# Altium schematic sheet MCU2.SchDoc: MCU2
size A3; DocumentNumber: MB1144; Revision: C-02; SheetNumber: 4; SheetTotal: 25; PageSetup: Record=PageOptions|CenterHorizontal=True|CenterVertical=True|PrintScale=1.04|XCorrection=1.00|YCorrection=1.00|PrintKind=1|BorderSize=5000000|LeftOffset=0|BottomOffset=0|Orientation=2|PaperLength=1000|PaperWidth=1000|Scale=100|PaperSource=7|PrintQuality=600|MediaType=1|DitherType=10|PaperKind=A3|PrintScaleMode=1; Project: STM32L476G-EVAL; ModifiedDate: 9/23/2015
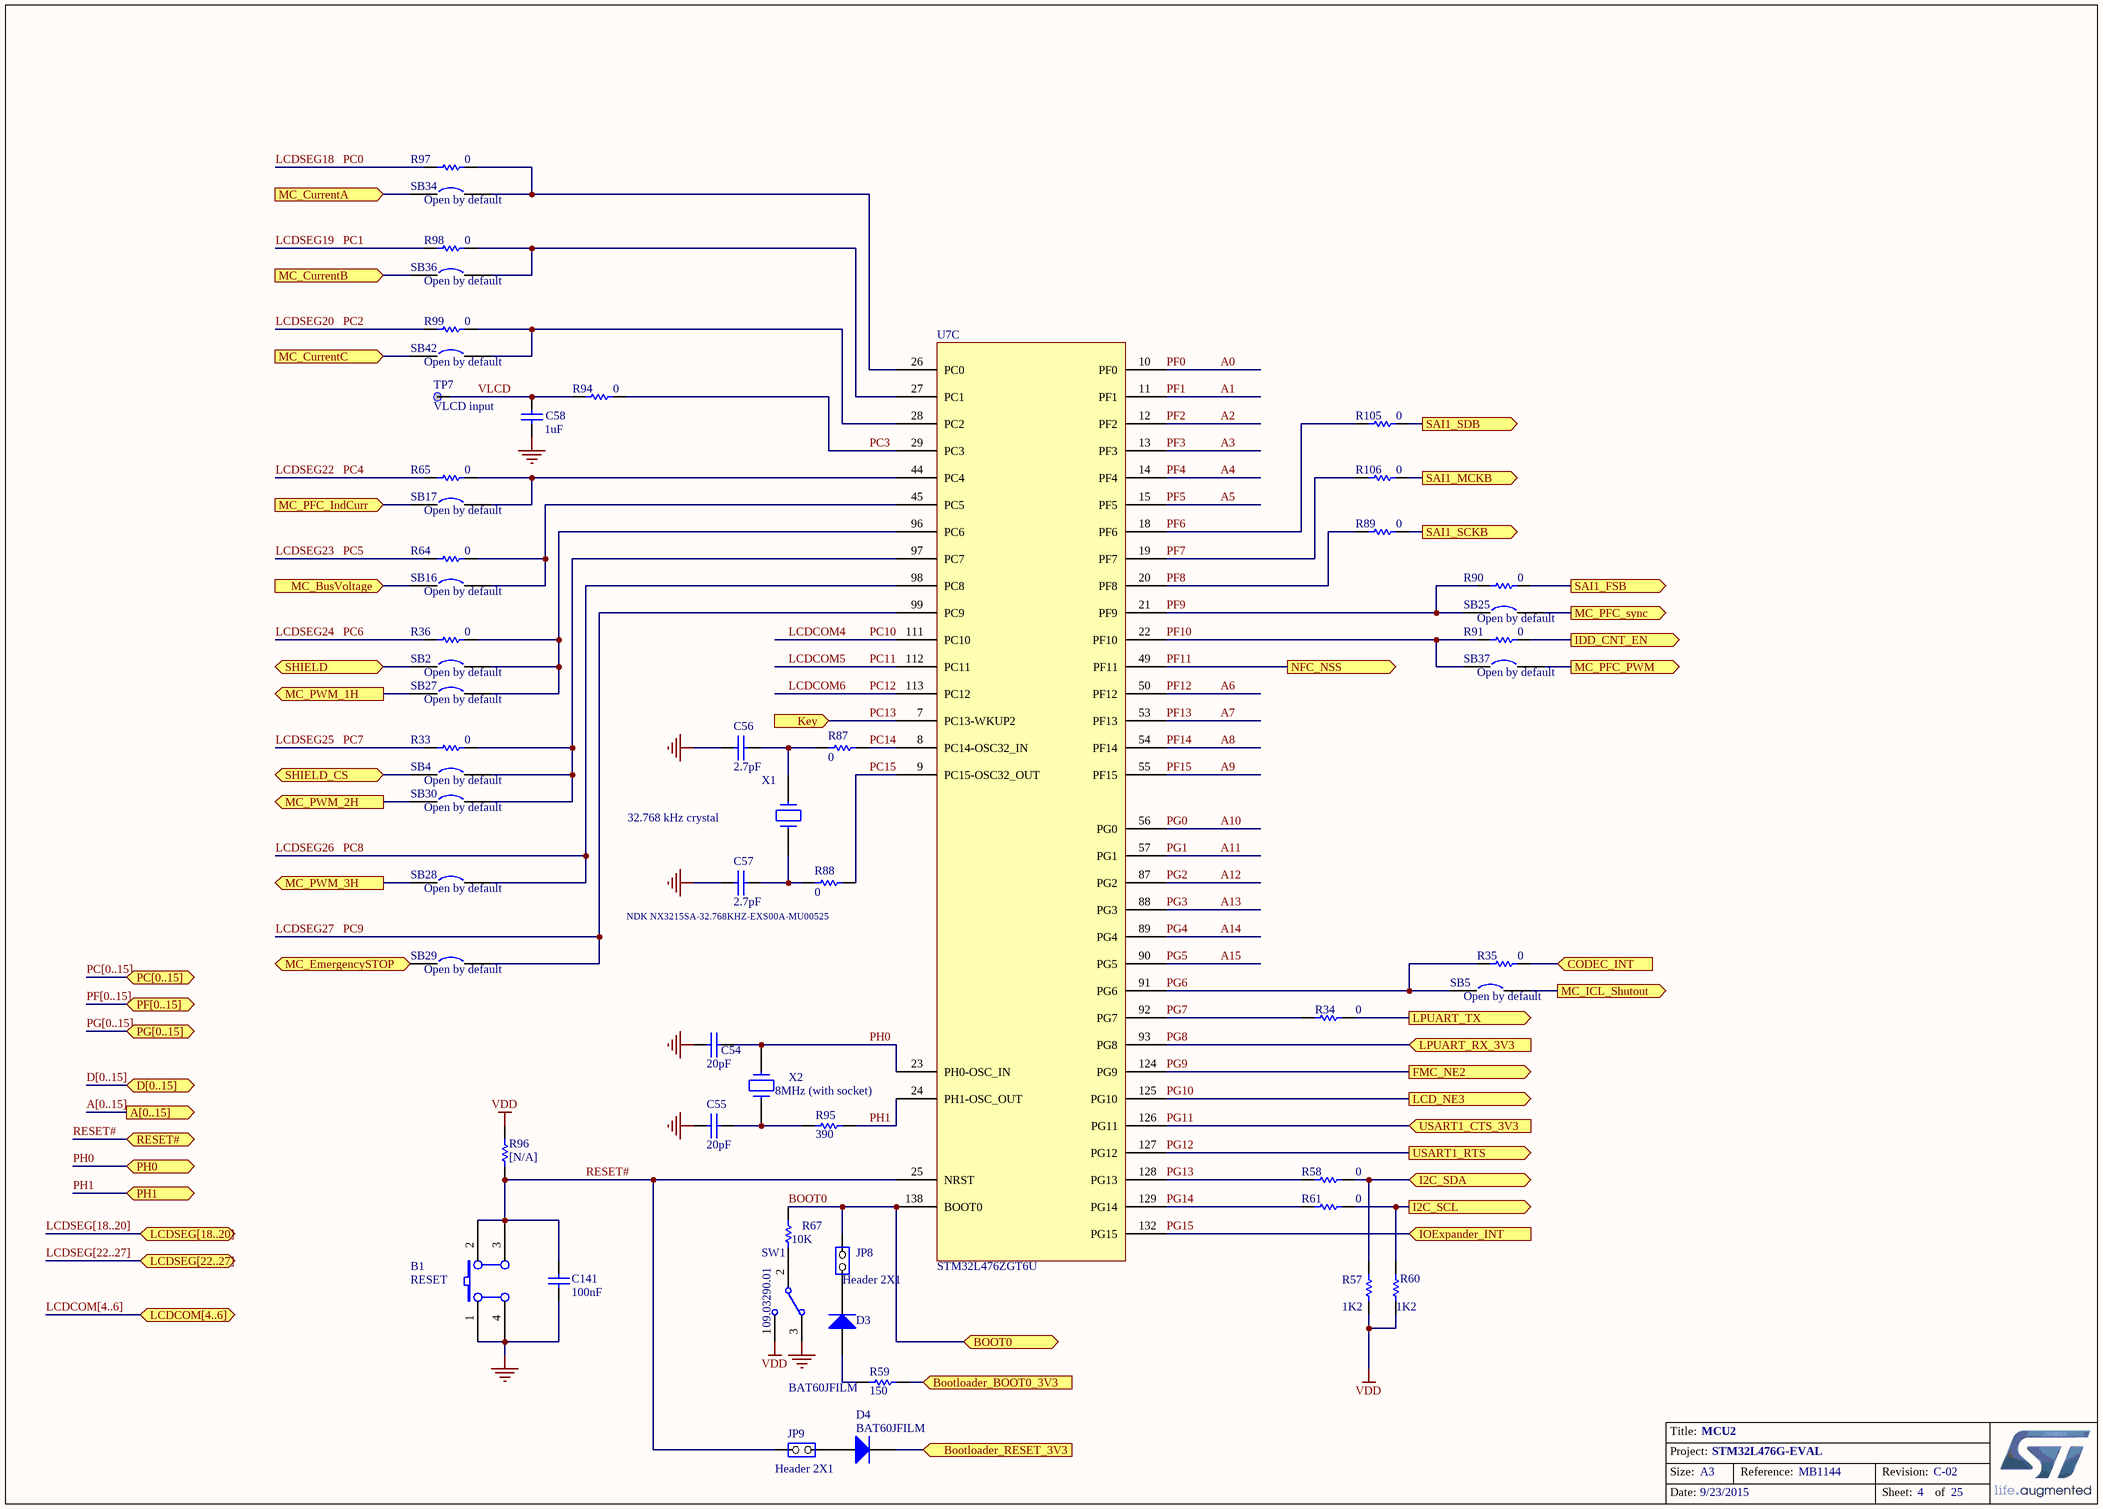
[diagram p0: MCU2.SchDoc]

## Parts
B1  RESET  [PB10]
C54  20pF  [0402R]
C55  20pF  [0402R]
C56  2.7pF  [0603C]
C57  2.7pF  [0603C]
C58  1uF  [0603C]
C141  100nF  [0402C]
D3  BAT60JFILM  [SOD-323]
D4  BAT60JFILM  [SOD-323]
JP8  Header 2X1  [SIP2]
JP9  Header 2X1  [SIP2]
R33  0  [SB_0603]
R34  0  [0603R]
R35  0  [SB_0603]
R36  0  [SB_0603]
R57  1K2  [0402R]
R58  0  [0603R]
R59  150  [0402R]
R60  1K2  [0402R]
R61  0  [0603R]
R64  0  [SB_0603]
R65  0  [SB_0603]
R67  10K  [0402R]
R87  0  [0603R]
R88  0  [0603R]
R89  0  [0603R]
R90  0  [SB_0603]
R91  0  [SB_0603]
R94  0  [0603R]
R95  390  [0603R]
R96  [N/A]  [0603R]
R97  0  [SB_0603]
R98  0  [SB_0603]
R99  0  [SB_0603]
R105  0  [0603R]
R106  0  [0603R]
SB2  Open by default  [SB_0603]
SB4  Open by default  [SB_0603]
SB5  Open by default  [SB_0603]
SB16  Open by default  [SB_0603]
SB17  Open by default  [SB_0603]
SB25  Open by default  [SB_0603]
SB27  Open by default  [SB_0603]
SB28  Open by default  [SB_0603]
SB29  Open by default  [SB_0603]
SB30  Open by default  [SB_0603]
SB34  Open by default  [SB_0603]
SB36  Open by default  [SB_0603]
SB37  Open by default  [SB_0603]
SB42  Open by default  [SB_0603]
SW1  09.03290.01  [SW1_3TH_2R54_10X2R5]
TP7  TP Name: VLCD input  [TP]  (hidden comment: [N/A])
U7  STM32L476ZGT6U  [TQFP144_0R5_22X22_SOCKET]  (part C of 3)
X1  NDK NX3215SA-32.768KHZ-EXS00A-MU00525  [XTAL_2SM_3R2X1R5]
X2  8MHz (with socket)  [XTAL_SOCKET]

## Ports
A[0..15] (out), BOOT0, Bootloader_BOOT0_3V3 (in), Bootloader_RESET_3V3 (in), CODEC_INT (in), D[0..15] (bidir), FMC_NE2 (out), I2C_SCL (out), I2C_SDA (bidir), IDD_CNT_EN (out), IOExpander_INT (in), Key (in), LCD_NE3 (out), LCDCOM[4..6] (bidir), LCDSEG[18..20] (bidir), LCDSEG[22..27] (bidir), LPUART_RX_3V3 (in), LPUART_TX (out), MC_BusVoltage (in), MC_CurrentA (in), MC_CurrentB (in), MC_CurrentC (in), MC_EmergencySTOP (in), MC_ICL_Shutout (out), MC_PFC_IndCurr (in), MC_PFC_PWM (out), MC_PFC_sync (out), MC_PWM_1H (out), MC_PWM_2H (out), MC_PWM_3H (out), NFC_NSS (out), PC[0..15] (bidir), PF[0..15] (bidir), PG[0..15] (bidir), PH0, PH1, RESET# (bidir), SAI1_FSB (out), SAI1_MCKB (out), SAI1_SCKB (out), SAI1_SDB (out), SHIELD, SHIELD_CS, USART1_CTS_3V3 (in), USART1_RTS (out)

## Nets
GND: B1.1(A0) B1.4(A1) C54.2 C55.2 C56.2 C57.2 C58.1 C141.1 SW1.3
VDD: R57.2 R60.2 R96.2 SW1.1
A0: U7.10(PF0)  [also labelled PF0]
A1: U7.11(PF1)  [also labelled PF1]
A2: U7.12(PF2)  [also labelled PF2]
A3: U7.13(PF3)  [also labelled PF3]
A4: U7.14(PF4)  [also labelled PF4]
A5: U7.15(PF5)  [also labelled PF5]
A6: U7.50(PF12)  [also labelled PF12]
A7: U7.53(PF13)  [also labelled PF13]
A8: U7.54(PF14)  [also labelled PF14]
A9: U7.55(PF15)  [also labelled PF15]
A10: U7.56(PG0)  [also labelled PG0]
A11: U7.57(PG1)  [also labelled PG1]
A12: U7.87(PG2)  [also labelled PG2]
A13: U7.88(PG3)  [also labelled PG3]
A14: U7.89(PG4)  [also labelled PG4]
A15: U7.90(PG5)  [also labelled PG5]
BOOT0: JP8.1(COMMON) R67.1 U7.138(BOOT0) ; port BOOT0
Bootloader_BOOT0_3V3: R59.2 ; port Bootloader_BOOT0_3V3
Bootloader_RESET_3V3: D4.2(K) ; port Bootloader_RESET_3V3
CODEC_INT: R35.1 ; port CODEC_INT
I2C_SCL: R60.1 R61.1 ; port I2C_SCL
I2C_SDA: R57.1 R58.1 ; port I2C_SDA
IDD_CNT_EN: R91.1 ; port IDD_CNT_EN
LCDCOM4: U7.111(PC10)  [also labelled PC10]
LCDCOM5: U7.112(PC11)  [also labelled PC11]
LCDCOM6: U7.113(PC12)  [also labelled PC12]
LCDSEG18: R97.1  [also labelled PC0]
LCDSEG19: R98.1  [also labelled PC1]
LCDSEG20: R99.1  [also labelled PC2]
LCDSEG22: R65.1  [also labelled PC4]
LCDSEG23: R64.1  [also labelled PC5]
LCDSEG24: R36.1  [also labelled PC6]
LCDSEG25: R33.1  [also labelled PC7]
LCDSEG26: SB28.2 U7.98(PC8)  [also labelled PC8]
LCDSEG27: SB29.2 U7.99(PC9)  [also labelled PC9]
LPUART_TX: R34.1 ; port LPUART_TX
MC_BusVoltage: SB16.1 ; port MC_BusVoltage
MC_CurrentA: SB34.1 ; port MC_CurrentA
MC_CurrentB: SB36.1 ; port MC_CurrentB
MC_CurrentC: SB42.1 ; port MC_CurrentC
MC_EmergencySTOP: SB29.1 ; port MC_EmergencySTOP
MC_ICL_Shutout: SB5.2 ; port MC_ICL_Shutout
MC_PFC_IndCurr: SB17.1 ; port MC_PFC_IndCurr
MC_PFC_PWM: SB37.2 ; port MC_PFC_PWM
MC_PFC_sync: SB25.2 ; port MC_PFC_sync
MC_PWM_1H: SB27.1 ; port MC_PWM_1H
MC_PWM_2H: SB30.1 ; port MC_PWM_2H
MC_PWM_3H: SB28.1 ; port MC_PWM_3H
PC3: R94.1 U7.29(PC3)
PC13: U7.7(PC13-WKUP2) ; port Key
PC14: R87.2 U7.8(PC14-OSC32_IN)
PC15: R88.2 U7.9(PC15-OSC32_OUT)
PF6: R105.2 U7.18(PF6)
PF7: R106.2 U7.19(PF7)
PF8: R89.2 U7.20(PF8)
PF9: R90.2 SB25.1 U7.21(PF9)
PF10: R91.2 SB37.1 U7.22(PF10)
PF11: U7.49(PF11) ; port NFC_NSS
PG6: R35.2 SB5.1 U7.91(PG6)
PG7: R34.2 U7.92(PG7)
PG8: U7.93(PG8) ; port LPUART_RX_3V3
PG9: U7.124(PG9) ; port FMC_NE2
PG10: U7.125(PG10) ; port LCD_NE3
PG11: U7.126(PG11) ; port USART1_CTS_3V3
PG12: U7.127(PG12) ; port USART1_RTS
PG13: R58.2 U7.128(PG13)
PG14: R61.2 U7.129(PG14)
PG15: U7.132(PG15) ; port IOExpander_INT
PH0: C54.1 U7.23(PH0-OSC_IN) X2.2 ; port PH0
PH1: R95.1 U7.24(PH1-OSC_OUT) ; port PH1
RESET#: B1.2(B0) B1.3(B1) C141.2 JP9.1(COMMON) R96.1 U7.25(NRST) ; port RESET#
SAI1_FSB: R90.1 ; port SAI1_FSB
SAI1_MCKB: R106.1 ; port SAI1_MCKB
SAI1_SCKB: R89.1 ; port SAI1_SCKB
SAI1_SDB: R105.1 ; port SAI1_SDB
SHIELD: SB2.1 ; port SHIELD
SHIELD_CS: SB4.1 ; port SHIELD_CS
VLCD: C58.2 R94.2 TP7.1
NetC55_1: C55.1 R95.2 X2.1
NetC56_1: C56.1 R87.1 X1.2
NetC57_1: C57.1 R88.1 X1.1
NetD3_1: D3.1(A) R59.1
NetD3_2: D3.2(K) JP8.2(NO)
NetD4_1: D4.1(A) JP9.2(NO)
NetR33_2: R33.2 SB4.2 SB30.2 U7.97(PC7)
NetR36_2: R36.2 SB2.2 SB27.2 U7.96(PC6)
NetR64_2: R64.2 SB16.2 U7.45(PC5)
NetR65_2: R65.2 SB17.2 U7.44(PC4)
NetR67_2: R67.2 SW1.2
NetR97_2: R97.2 SB34.2 U7.26(PC0)
NetR98_2: R98.2 SB36.2 U7.27(PC1)
NetR99_2: R99.2 SB42.2 U7.28(PC2)

## Buses and harness runs
bus A[0..15] = port A[0..15]
bus D[0..15] = port D[0..15]
bus LCDCOM[4..6] = port LCDCOM[4..6]
bus LCDSEG[18..20] = port LCDSEG[18..20]
bus LCDSEG[22..27] = port LCDSEG[22..27]
bus PC[0..15] = port PC[0..15]
bus PF[0..15] = port PF[0..15]
bus PG[0..15] = port PG[0..15]

## Notes on the sheet
- 32.768 kHz crystal
- Title:
- Project:
- Size:
- Date:
- A3
- Reference:
- Sheet:
- Revision:
- of

## Library data of the parts
B1 = SW PUSHBUTTON: SE PUSHBUTTON; Ordered by: Subcon; Comments: no comment; Assembly: Black; ECCN_US/EU: NA
C54-C57 = CAP: Capacitor; Ordered by: Subcon; ECCN_US/EU: NA
C58 = CAP: Capacitor; Value: 100nF; Ordered by: Subcon; ECCN_US/EU: NA; Published: 8-Jun-2000; Revision: July-2002: Re-released for DXP Platform.; Publisher: Altium Limited
C141 = CAP: Capacitor; Value: 100pF; Ordered by: Subcon; ECCN_US/EU: NA; Published: 8-Jun-2000; Revision: July-2002: Re-released for DXP Platform.; Publisher: Altium Limited
D3 D4 = Diode: Default Diode; Code - JEDEC: DO-214-AB; Ordered by: ST; ECCN_US/EU: EAR99/NEC; Ref St: 9151097; Published: 8-Jun-2000; Revision: July-2002: Re-released for DXP Platform.; Publisher: Altium Limited; Manuf_1: ST; Manuf_Part_1: BAT60JFILM
JP8 JP9 = JP2: Ordered by: Subcon; ECCN_US/EU: NA
R33 R34 R36 R57 R58 R60 R61 R64 R65 R87 R88 R95 R97-R99 = Res1: Resistor; Value: 1K; Ordered by: Subcon; ECCN_US/EU: NA; Published: 8-Jun-2000; Revision: July-2002: Re-released for DXP Platform.; Publisher: Altium Limited
R35 R59 R67 R89-R91 R94 R105 R106 = res1: Resistor; Value: 1K; Ordered by: Subcon; ECCN_US/EU: NA; Published: 8-Jun-2000; Revision: July-2002: Re-released for DXP Platform.; Publisher: Altium Limited
R96 = res1: Resistor; Value: 1K; Ordered by: Subcon; ECCN_US/EU: NA; Fitted: NO; Published: 8-Jun-2000; Revision: July-2002: Re-released for DXP Platform.; Publisher: Altium Limited
SB2 SB4 SB5 SB16 SB17 SB25 SB27-SB30 SB34 SB36 SB37 SB42 = Circuit Breaker: Ordered by: Subcon; Comments: Solder bridge; Fitted: NO; ECCN_US/EU: NA; Published: 24-Mar-1999; Revision: July-2002: Re-released for DXP Platform.; Publisher: Altium Limited
SW1 = SW-SPDT: SPDT Subminiature Toggle Switch, Right Angle Mounting, Vertical Actuation; Revision 1: Jul-2002: Re-released for DXP Platform.; Revision 2: 17-Dec-2003: Schematic revised, PCB Footprint replaced.; Ordered by: Subcon; ECCN_US/EU: NA; Published: 24-Mar-1999; Datasheet: Latest Revision: 05-Dec-2000; Publisher: Altium Limited
TP7 = TP: Ordered by: Subcon; Fitted or not fitted: NO; ECCN_US/EU: NA; Fitted: NO
U7 = STM32L476_TQFP144: Manuf_Part_1: STM32L476ZGT6U cut1.3; Ordered by: ST; ECCN_US/EU: 3A991A2/NEC; Assembly: MCU; Ref St: 9175195; Manuf_1: ST
X1 = CRYSTAL_32K: Crystal; Ordered by: ST; ECCN_US/EU: NA; Manuf_1: NDK; Manuf_Part_1: NX3215SA-32.768KHZ-EXS00A-MU00525
X2 = CRYSTAL: Manuf_1: jfvny; Manuf_Part_1: HC-49S-C16QSA-8M; Ordered by: Subcon; ECCN_US/EU: NA; Assembly: with socket